# Altium schematic sheet rs232_12V_step.SchDoc: Драйвер двигателя
size 594 x 420 mm; ApprovedBy: Рогов; CheckedBy: Капустин; DrawnBy: Тришин; DocumentNumber: rs232_12V_step Э3; SheetTotal: 1; Format: A2; DocumentType: Электрическая принципиальная; ImagePath: rs232_12V_step
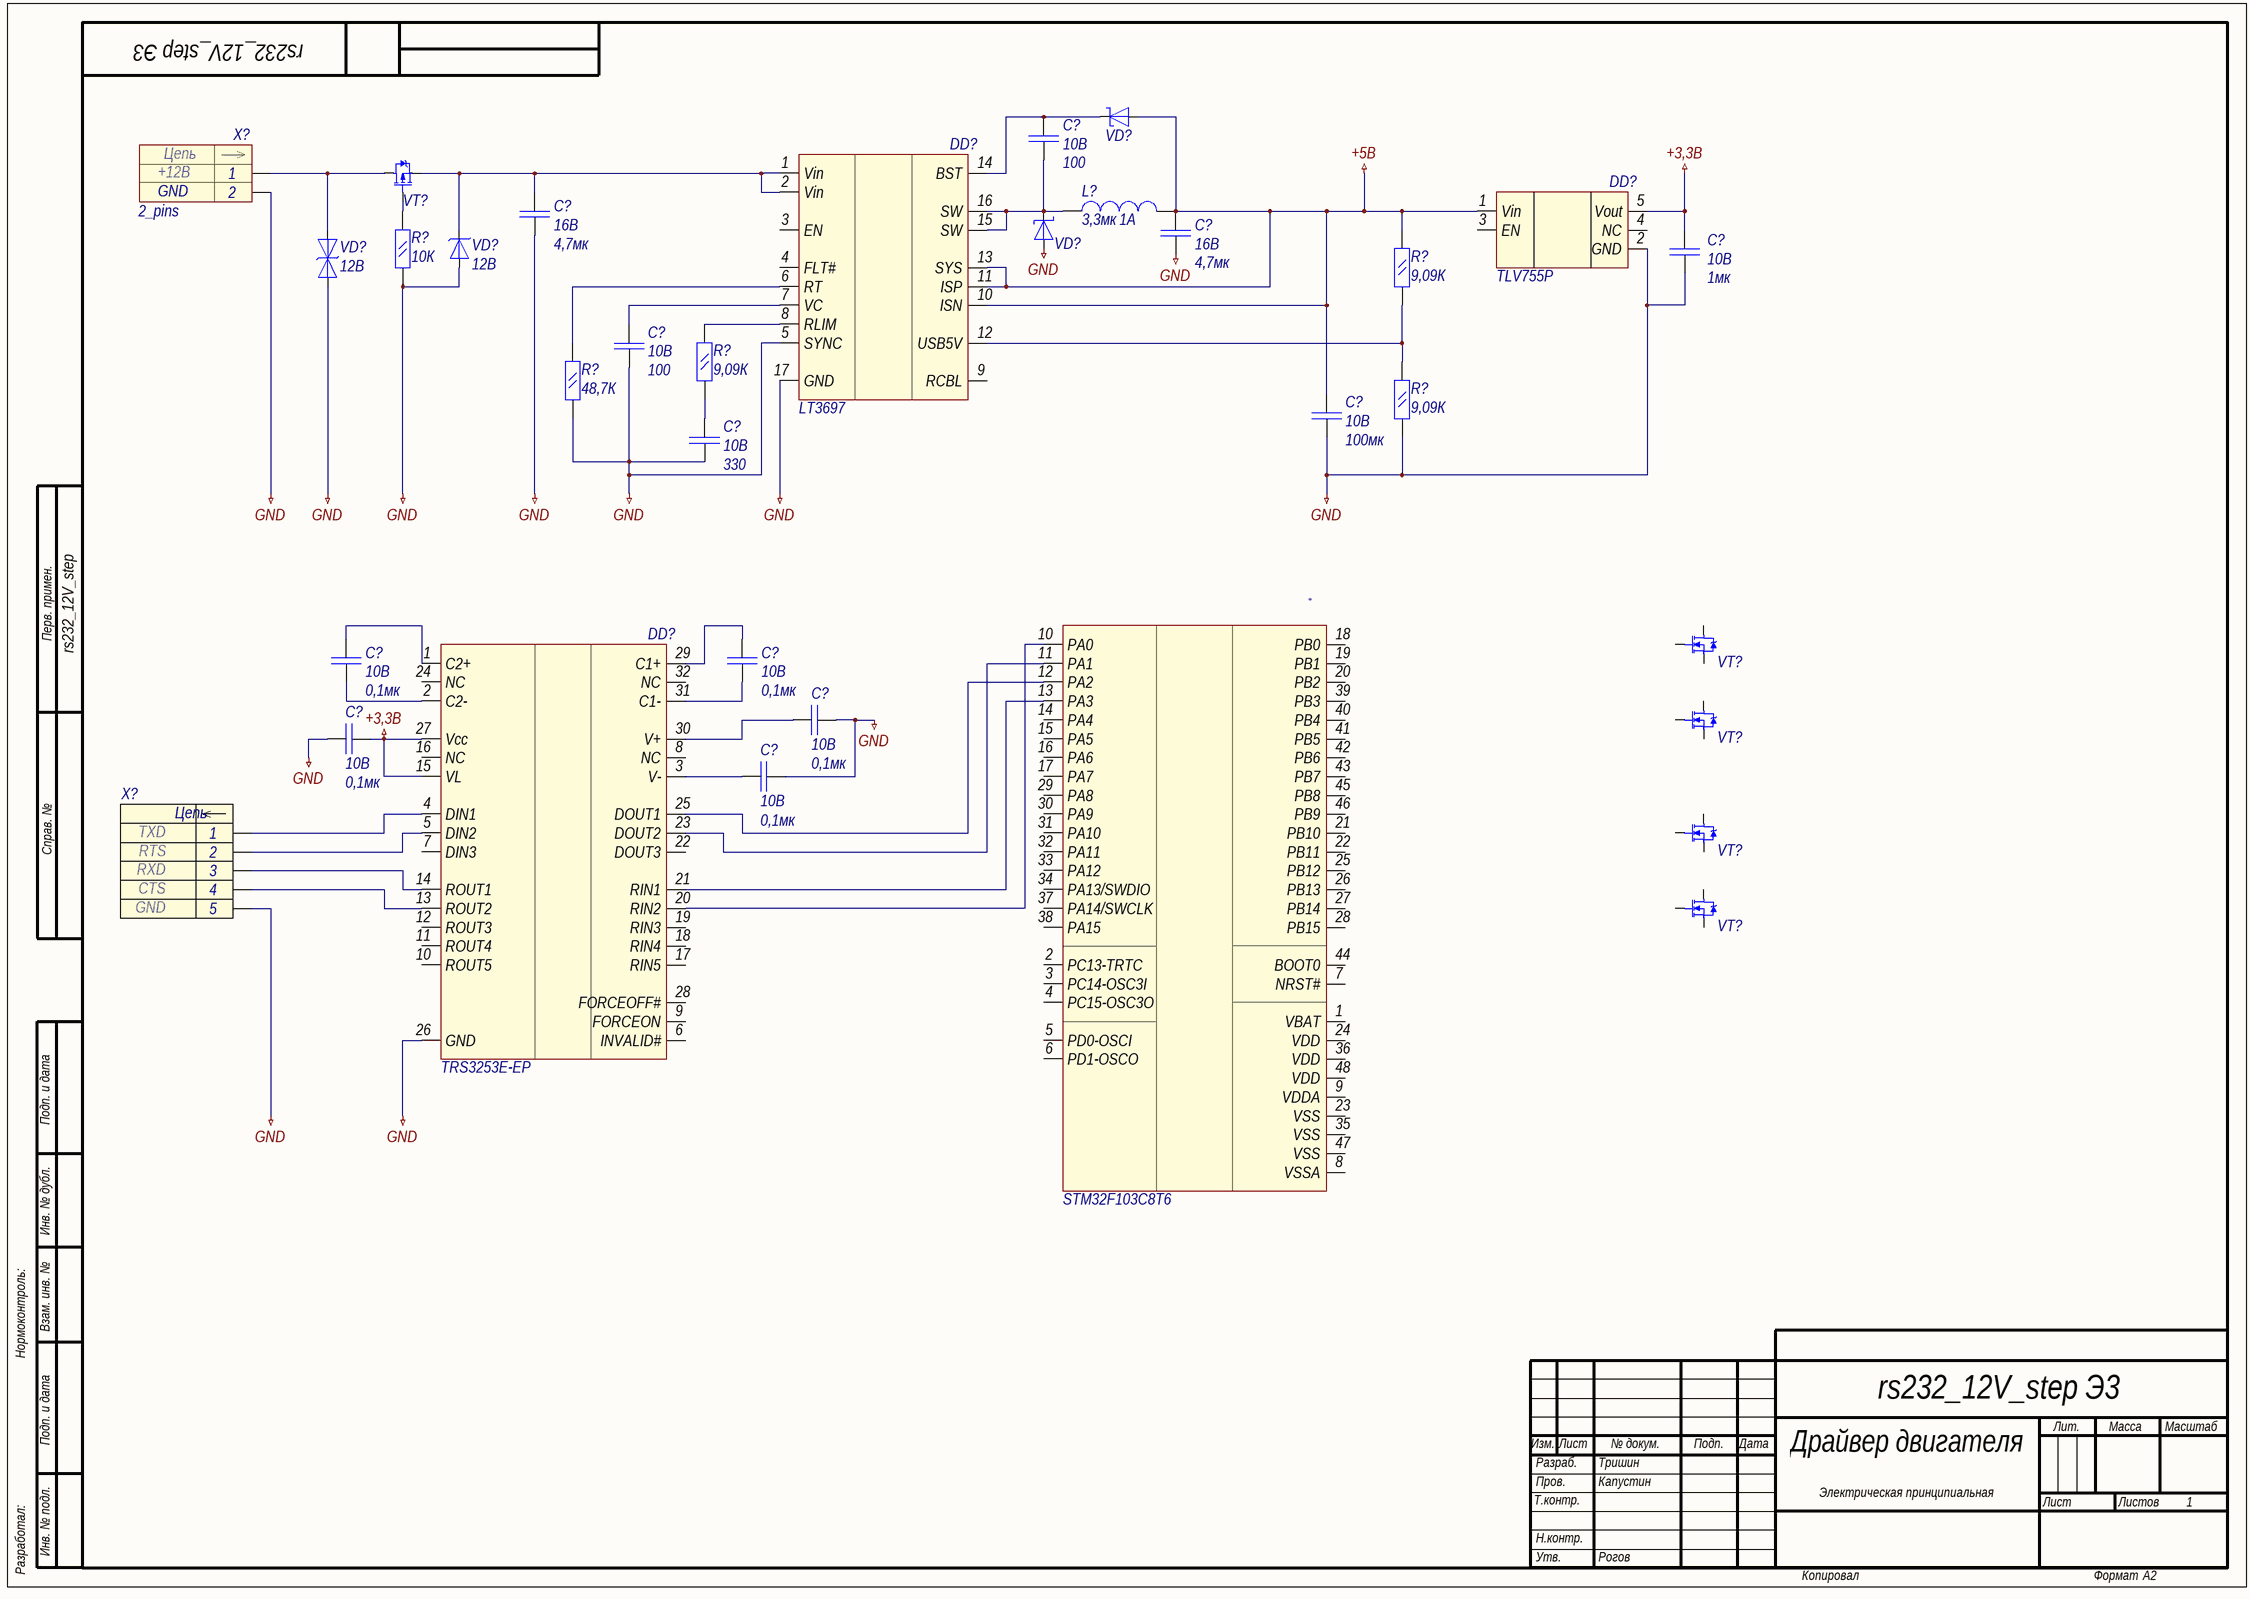
[diagram p0: rs232_12V_step.SchDoc]

## Parts
(Parts that share a designator on the sheet are numbered #1, #2 ... from top to bottom, then left to right.)
*  STM32F103C8T6
C?#1  Voltage: 10В  Capacitance: 100  [CH0201C]  (hidden comment: Capacitor)
C?#2  Voltage: 16В  Capacitance: 4,7мк  [CH0603C]  (hidden comment: Capacitor)
C?#3  Voltage: 16В  Capacitance: 4,7мк  [CH0603C]  (hidden comment: Capacitor)
C?#4  Voltage: 10В  Capacitance: 1мк  [CH0201C]  (hidden comment: Capacitor)
C?#5  Voltage: 10В  Capacitance: 100  [CH0201C]  (hidden comment: Capacitor)
C?#6  Voltage: 10В  Capacitance: 100мк  [CH1206C]  (hidden comment: Capacitor)
C?#7  Voltage: 10В  Capacitance: 330  [CH0402C]  (hidden comment: Capacitor)
C?#8  Voltage: 10В  Capacitance: 0,1мк  [CH0402C]  (hidden comment: Capacitor)
C?#9  Voltage: 10В  Capacitance: 0,1мк  [CH0402C]  (hidden comment: Capacitor)
C?#10  Voltage: 10В  Capacitance: 0,1мк  [CH0402C]  (hidden comment: Capacitor)
C?#11  Voltage: 10В  Capacitance: 0,1мк  [CH0402C]  (hidden comment: Capacitor)
C?#12  Voltage: 10В  Capacitance: 0,1мк  [CH0402C]  (hidden comment: Capacitor)
DD?#1  LT3697  [LT3697]
DD?#2  TLV755P  [SOT23-5]
DD?#3  TRS3253E-EP  [TRS3253E-EP]
L?  Max current: 1А  Inductance: 3,3мк  [CH0805L]  (hidden comment: *)
R?#1  Impedance: 9,09К  [CH0805R]  (hidden comment: Res_0.125)
R?#2  Impedance: 10К  [CH0402R]  (hidden comment: Res_0.125)
R?#3  Impedance: 9,09К  [CH0805R]  (hidden comment: Res_0.125)
R?#4  Impedance: 48,7К  [CH0805R]  (hidden comment: Res_0.125)
R?#5  Impedance: 9,09К  [CH0805R]  (hidden comment: Res_0.125)
VD?#1  Diod Schottky  [SOT23_132]  (value not drawn)
VD?#2  Diod Schottky  [DO214AA]  (value not drawn)
VD?#3  Clamping_Voltage: 12В  [DO214AA]  (hidden comment: TVS-diod_directed)
VD?#4  Clamping Voltage: 12В  [CH0201L]  (hidden comment: TVS-diod_simmetrical)
VT?#1  *  [SOT23_132]  (value not drawn)
VT?#2  N-Channel  (value not drawn)
VT?#3  N-Channel  (value not drawn)
VT?#4  N-Channel  (value not drawn)
VT?#5  N-Channel  (value not drawn)
X?#1  2_pins  Vcc: +12В  [CON: 163-179PH-EX]
X?#2  1: TXD  2: RTS  3: RXD  4: CTS  5: GND  (hidden comment: 5_pins)

## Nets
+3,3В: C?#4.1(C1+) C?#11.2(C1-) DD?#2.5(Vout) DD?#3.15(VL) DD?#3.27(Vcc)
+5В: C?#3.1(C1+) C?#6.1(C1+) DD?#1.10(ISN) DD?#1.11(ISP) DD?#1.13(SYS) DD?#2.1(Vin) L?.2 R?#1.1(C1-) VD?#1.1
GND: C?#2.2(C1-) C?#3.2(C1-) C?#4.2(C1-) C?#5.2(C1-) C?#6.2(C1-) C?#7.2(C1-) C?#10.2(C1-) C?#11.1(C1+) C?#12.2(C1-) DD?#1.5(SYNC) DD?#1.17(GND) DD?#2.2(GND) DD?#3.26(GND) R?#2.1(C1-) R?#4.2(C1-) R?#5.2(C1-) VD?#2.1 VD?#3.1(A) VD?#4.1(A) X?#1.2 X?#2.5
Net*_10: *.10(PA0) DD?#3.20(RIN2)
Net*_11: *.11(PA1) DD?#3.23(DOUT2)
Net*_12: *.12(PA2) DD?#3.25(DOUT1)
Net*_13: *.13(PA3) DD?#3.21(RIN1)
NetC?#1_1: C?#1.1(C1+) DD?#1.14(BST) VD?#1.2
NetC?#1_2: C?#1.2(C1-) DD?#1.15(SW) DD?#1.16(SW) L?.1(C1-) VD?#2.2
NetC?#2_1: C?#2.1(C1+) DD?#1.1(Vin) DD?#1.2(Vin) VD?#3.2(C) VT?#1.3(S)
NetC?#5_1: C?#5.1(C1+) DD?#1.7(VC)
NetC?#7_1: C?#7.1(C1+) R?#3.2(C1-)
NetC?#8_1: C?#8.1(C1+) DD?#3.1(C2+)
NetC?#8_2: C?#8.2(C1-) DD?#3.2(C2-)
NetC?#9_1: C?#9.1(C1+) DD?#3.29(C1+)
NetC?#9_2: C?#9.2(C1-) DD?#3.31(C1-)
NetC?#10_1: C?#10.1(C1+) DD?#3.30(V+)
NetC?#12_1: C?#12.1(C1+) DD?#3.3(V-)
NetDD?#1_6: DD?#1.6(RT) R?#4.1(C1-)
NetDD?#1_8: DD?#1.8(RLIM) R?#3.1(C1-)
NetDD?#1_12: DD?#1.12(USB5V) R?#1.2(C1-) R?#5.1(C1-)
NetDD?#3_4: DD?#3.4(DIN1) X?#2.1
NetDD?#3_5: DD?#3.5(DIN2) X?#2.2
NetDD?#3_13: DD?#3.13(ROUT2) X?#2.4
NetDD?#3_14: DD?#3.14(ROUT1) X?#2.3
NetR?#2_2: R?#2.2(C1-) VT?#1.1(G)
NetVD?#4_2: VD?#4.2(C) VT?#1.2(D) X?#1.1

Not connected (* = marked no-connect by the designer): * 1(VBAT) 2(PC13-TRTC) 3(PC14-OSC3I) 4(PC15-OSC3O) 5(PD0-OSCI) 6(PD1-OSCO) 7(NRST#) 8(VSSA) 9(VDDA) 14(PA4) 15(PA5) 16(PA6) 17(PA7) 18(PB0) 19(PB1) 20(PB2) 21(PB10) 22(PB11) 23(VSS) 24(VDD) 25(PB12) 26(PB13) 27(PB14) 28(PB15) 29(PA8) 30(PA9) 31(PA10) 32(PA11) 33(PA12) 34(PA13/SWDIO) 35(VSS) 36(VDD) 37(PA14/SWCLK) 38(PA15) 39(PB3) 40(PB4) 41(PB5) 42(PB6) 43(PB7) 44(BOOT0) 45(PB8) 46(PB9) 47(VSS) 48(VDD); DD?#1 3(EN) 4(FLT#) 9(RCBL); DD?#2 3(EN) 4(NC); DD?#3 6(INVALID#) 7(DIN3) 8(NC) 9(FORCEON) 10(ROUT5) 11(ROUT4) 12(ROUT3) 16(NC) 17(RIN5) 18(RIN4) 19(RIN3) 22(DOUT3) 24(NC) 28(FORCEOFF#) 32(NC); VT?#2 1(G) 2(D) 3(S); VT?#3 1(G) 2(D) 3(S); VT?#4 1(G) 2(D) 3(S); VT?#5 1(G) 2(D) 3(S)

## Notes on the sheet
- Перв. примен.
- Справ. №
- Подп. и дата
- Инв. № дубл.
- Нормоконтроль:
- Взам. инв. №
- Изм.
- Лист
- № докум.
- Подп.
- Дата
- Лит.
- Масса
- Масштаб
- Т.контр.
- Пров.
- Разраб.
- Листов
- Разработал:
- Инв. № подл.
- Н.контр.
- Утв.
- Копировал
- Формат
- (in symbol 2_pins) Цепь; GND
- (in symbol 5_pins) Цепь

## Library data of the parts
* = STM32
C?#1 C?#5 = Capacitor: Manufacture: KEMET; Model: C0201C101K8GACTU; Case: 0201; HelpURL: https://ru.mouser.com/ProductDetail/KEMET/C0201C101K8GACTU?qs=sGAEpiMZZMs0AnBnWHyRQB5KqWiNAtmEn9gsTWOdKS%252b7RrFbxqtALA%3d%3d
C?#2 C?#3 = Capacitor: Manufacture: Murata Electronics; Model: GRM188R61C475KAAJD; Case: 0603; HelpURL: https://ru.mouser.com/ProductDetail/Murata-Electronics/GRM188R61C475KAAJD?qs=sGAEpiMZZMs0AnBnWHyRQHS%2f3XE0oMwxE3tFP4oDIiY%3d
C?#4 = Capacitor: Manufacture: Murata Electronics; Model: GRM033C81A105ME05E; Case: 0201; HelpURL: https://ru.mouser.com/ProductDetail/Murata-Electronics/GRM033C81A105ME05E?qs=sGAEpiMZZMs0AnBnWHyRQN7%2fAA2D2lPPXfhIkJ3ChWM%252bNp28BKy3Ug%3d%3d
C?#6 = Capacitor: Manufacture: TDK; Model: C3216X5R1A107M160AC; Case: 1206; HelpURL: https://ru.mouser.com/ProductDetail/TDK/C3216X5R1A107M160AC?qs=sGAEpiMZZMs0AnBnWHyRQEWjzA2rN6H9eWVfGykJv7Q%3d
C?#7 = Capacitor: Manufacture: Vishay / Vitramon; Model: VJ0402Y331MXQCW1BC; Case: 0402; HelpURL: https://ru.mouser.com/ProductDetail/Vishay-Vitramon/VJ0402Y331MXQCW1BC?qs=sGAEpiMZZMs0AnBnWHyRQHefeAIkSpb%2fKjIwGvKZvs8%3d
C?#8-C?#12 = Capacitor: Manufacture: AVX; Model: 0402ZD103KAT2A; Case: 0402; HelpURL: https://ru.mouser.com/ProductDetail/AVX/0402ZD103KAT2A?qs=sGAEpiMZZMs0AnBnWHyRQKdiqyDPVQdAu74W%2fwwRq8A%3d
DD?#1 = LT3697: 6~18 to 5; Manufacture: Analog Devices; Model: LT3697; HelpURL: https://www.analog.com/en/products/lt3697.html; Case: *
DD?#2 = LDO +3.3V: Manufacture: Texas Instruments; Case: SOT-23; HelpUrL: http://www.ti.com/product/TLV755P?keyMatch=TLV755P&tisearch=Search-EN-Everything; Model: TLV755P
DD?#3 = TRS3253E-EP: UART - RS232; Manufacture: Texas Instruments; Model: TRS3253E-EP; Case: PQFN-32; HelpURL: http://www.ti.com/product/trs3253e-ep
L? = Inductor: Manufacture: Murata Electronics; Model: LQM21PZ3R3MGRD; Impedance: 150м; HelpURL: https://ru.mouser.com/ProductDetail/Murata-Electronics/LQM21PZ3R3MGRD?qs=sGAEpiMZZMsg%252by3WlYCkU2iuTbKTbm6Zxs6Ix4GkUPA%3d; Case: 0805
R?#1 R?#3 R?#5 = Res_0.125: Manufacture: Panasonic Industrial Devices; Model: ERJ-6ENF9091V; Case: 0805; HelpURL: https://ru.mouser.com/ProductDetail/Panasonic-Industrial-Devices/ERJ-6ENF9091V?qs=sGAEpiMZZMvdGkrng054tx7%2f6%252bNA3LAJZkxjwUnWjWM%3d
R?#2 = Res_0.125: Manufacture: Yageo; Model: AC0402FR-7W10KL; Case: 0402; HelpURL: https://ru.mouser.com/ProductDetail/Yageo/AC0402FR-7W10KL?qs=sGAEpiMZZMvdGkrng054txbN%2f5LBcxld3gyqgmBuiXRPLjwmdNqO3A%3d%3d
R?#4 = Res_0.125: Manufacture: Panasonic Industrial Devices; Model: ERJ-6ENF4872V; Case: 0805; HelpURL: https://ru.mouser.com/ProductDetail/Panasonic-Industrial-Devices/ERJ-6ENF4872V?qs=sGAEpiMZZMvdGkrng054tx7%2f6%252bNA3LAJLLBsBMFOrm0%3d
VD?#1 = Diod Schottky: Manufacturer: Toshiba; Model: 1SS374(TE85L,F); If: 200мА; Vrrm: 15В; ComponentKind: *; HelpURL: https://ru.mouser.com/ProductDetail/Toshiba/1SS374TE85LF?qs=sGAEpiMZZMtQ8nqTKtFS%2fOl9H8JU2QXlyYvmz0vcRmull8rlMQPxpQ%3d%3d
VD?#2 = Diod Schottky: Manufacturer: Rectron; Model: FM5822B-W; If: 3А; Vrrm: 40В; ComponentKind: *; HelpURL: https://ru.mouser.com/ProductDetail/Rectron/FM5822B-W?qs=sGAEpiMZZMtQ8nqTKtFS%2fGuc2LbLh1yNV0sywe9%2fy3k%3d
VD?#3 = TVS-diod_directed: Manufacturer: Bourns; Model: CD214B-T7.0ALF; HelpURL: https://ru.mouser.com/ProductDetail/Bourns/CD214B-T70ALF?qs=sGAEpiMZZMsItbzKdwyIexL102H4jKkFOiaKL2EcEgo%3d; Ipp: *; Case: DO-214AA-2
VD?#4 = TVS-diod_simmetrical: Manufacturer: Littelfuse; Model: SP3022-01WTG; HelpURL: https://ru.mouser.com/ProductDetail/Littelfuse/SP3022-01WTG?qs=sGAEpiMZZMsItbzKdwyIez7NGmqnzL8h47KYC2e%252bM%2f4NVETz1A7KGA%3d%3d; Case: 0201
VT?#1 = P-Channel: Manufacture: Diodes Incorporated; Id: 2,4А; Model: DMG2301LK-7; Vgs: 300мВ; Vsd: 20В; HelpURL: https://ru.mouser.com/ProductDetail/Diodes-Incorporated/DMG2301LK-7?qs=sGAEpiMZZMshyDBzk1%2fWi3VK%2fMVeCy7TGgocA8mg7FfG8rajAhy0Kw%3d%3d
VT?#2-VT?#5 = N-Channel: U_gs: *; HelpURL: *; Model: *; Manufacture: *; U_sd: *; I_d: *; Case: *
X?#1 = 2_pins: HelpURL: https://ru.farnell.com/gct-global-connector-technology/dcj250-10-a-k1-k/dc-power-jack-5a-20vdc-black/dp/2524130?st=power%20jack
X?#2 = 5_pins: HelpURL: *; Manufacture: *; Model: *; Case: *